# EAGLE design esquemático (EAGLE 9.6.2)
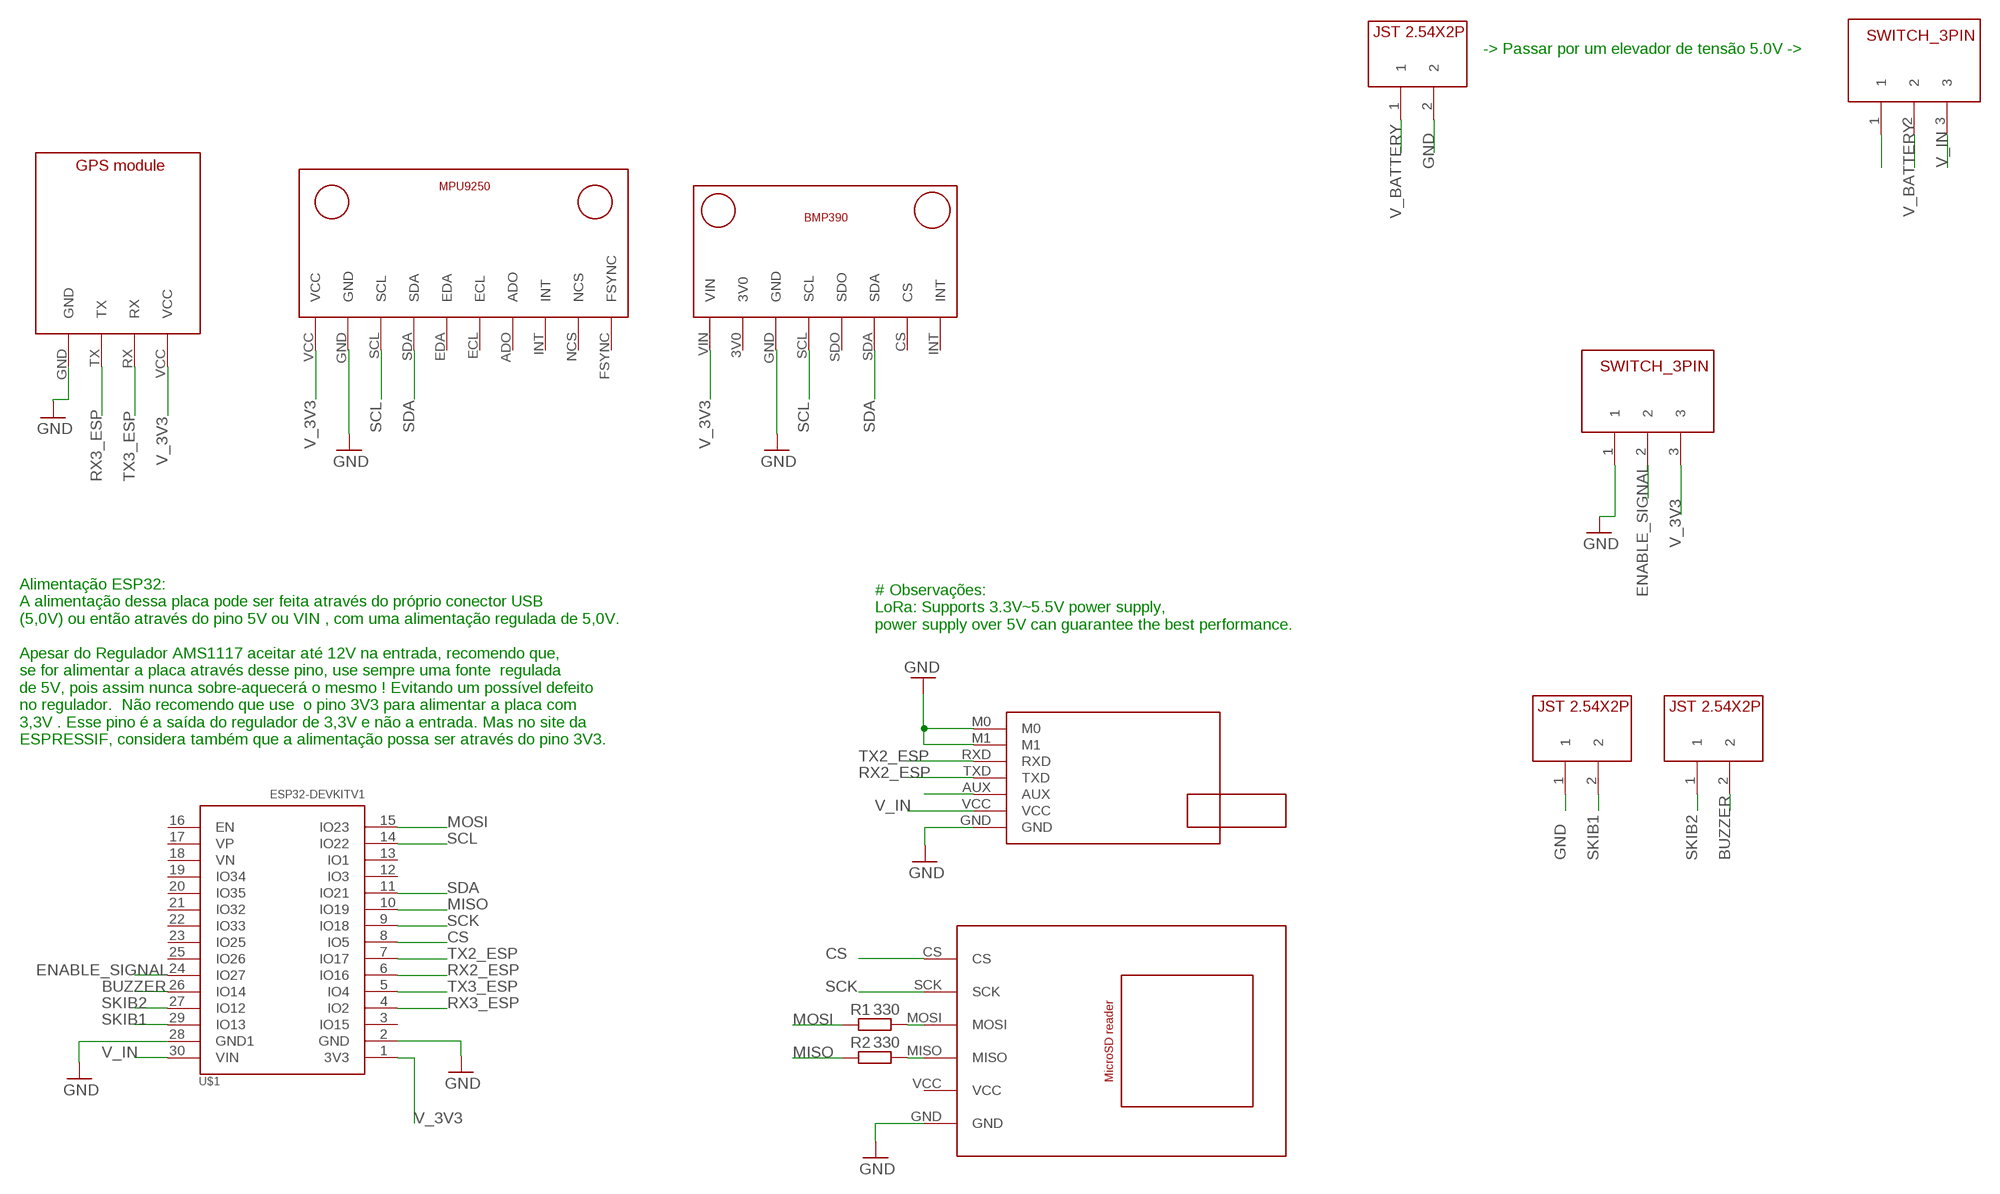
[diagram p0: schematic, sheet 1]

## Parts
R1  330  R-EU_0207/10  [0207/10]
R2  330  R-EU_0207/10  [0207/10]
U$1  ESP32DEVKITV1  [ESP32-DEVKITV1]
U$2  E22-400T30D  [E22-400T30D_FOOTPRINT]
U$3  GPS_MODULE  [GPS_MODULE_FOOTPRINT]
U$5  BMP390V1  [BMP390_FOOTPRINT]
U$6  MPU9250V1  [MPU9250_FOOTPRINT]
U$7  MICROSD_READER  [MICROSD_READER_FOOTPRINT]
U$8  JST2.54X2P  [JST2.54X2P_FOOTPRINT]
U$9  JST2.54X2P  [JST2.54X2P_FOOTPRINT]
U$10  SWITCH_3PIN  [SWITCH_3PIN]
U$11  SWITCH_3PIN  [SWITCH_3PIN]
U$12  JST2.54X2P  [JST2.54X2P_FOOTPRINT]

## Nets
BUZZER: U$1.26(IO14) U$9.2
CS: U$1.8(IO5) U$7.CS
ENABLE_SIGNAL: U$1.24(IO27) U$10.2
GND: U$1.2(GND) U$1.28(GND1) U$2.GND U$2.M0 U$2.M1 U$3.GND U$5.GND U$6.GND U$7.GND U$8.1 U$10.1 U$12.2
MISO: R2.1 U$1.10(IO19)
MOSI: R1.1 U$1.15(IO23)
N$1: R1.2 U$7.MOSI
N$2: R2.2 U$7.MISO
N$3: U$2.AUX
N$4: U$11.1
RX2_ESP: U$1.6(IO16) U$2.TXD
RX3_ESP: U$1.4(IO2) U$3.TX
SCK: U$1.9(IO18) U$7.SCK
SCL: U$1.14(IO22) U$5.SCL U$6.SCL
SDA: U$1.11(IO21) U$5.SDA U$6.SDA
SKIB1: U$1.29(IO13) U$8.2
SKIB2: U$1.27(IO12) U$9.1
TX2_ESP: U$1.7(IO17) U$2.RXD
TX3_ESP: U$1.5(IO4) U$3.RX
V_3V3: U$1.1(3V3) U$3.VCC U$5.VIN U$6.VCC U$10.3
V_BATTERY: U$11.2 U$12.1
V_IN: U$1.30(VIN) U$2.VCC U$11.3
Unconnected: U$1.3(IO15) U$1.12(IO3) U$1.13(IO1) U$1.16(EN) U$1.17(VP) U$1.18(VN) U$1.19(IO34) U$1.20(IO35) U$1.21(IO32) U$1.22(IO33) U$1.23(IO25) U$1.25(IO26) U$5.3V0 U$5.CS U$5.INT U$5.SDO U$6.ADO U$6.ECL U$6.EDA U$6.FSYNC U$6.INT U$6.NCS U$7.VCC

## Notes on the sheet
- -> Passar por um elevador de tensão 5.0V ->
- # Observações:
  LoRa: Supports 3.3V~5.5V power supply, 
  power supply over 5V can guarantee the best performance.
- Alimentação ESP32:
  A alimentação dessa placa pode ser feita através do próprio conector USB
  (5,0V) ou então através do pino 5V ou VIN , com uma alimentação regulada de 5,0V.
  
  Apesar do Regulador AMS1117 aceitar até 12V na entrada, recomendo que,
  se for alimentar a placa através desse pino, use sempre uma fonte  regulada
  de 5V, pois assim nunca sobre-aquecerá o mesmo ! Evitando um possível defeito
  no regulador.  Não recomendo que use  o pino 3V3 para alimentar a placa com
  3,3V . Esse pino é a saída do regulador de 3,3V e não a entrada. Mas no site da
  ESPRESSIF, considera também que a alimentação possa ser através do pino 3V3.

## Library data of the parts
R1 R2 = rcl:R-EU_: RESISTOR, European symbol; SPICEPREFIX: R
U$1 = ESP32-DEVKITV1:ESP32DEVKITV1
U$2 = CRD:E22-400T30D
U$3 = CRD:GPS_MODULE
U$5 = CRD:BMP390: Sensor barométrico
U$6 = CRD:MPU9250: Acelerômetro e Giroscópio
U$7 = CRD:MICROSD_READER: Leitor e gravador de cartão SD
U$8 U$9 U$12 = CRD:JST2.54X2P: Conector JST 2 pinos (2.54mm de distância entre pinos)
U$10 U$11 = CRD:SWITCH_3PIN

## Board
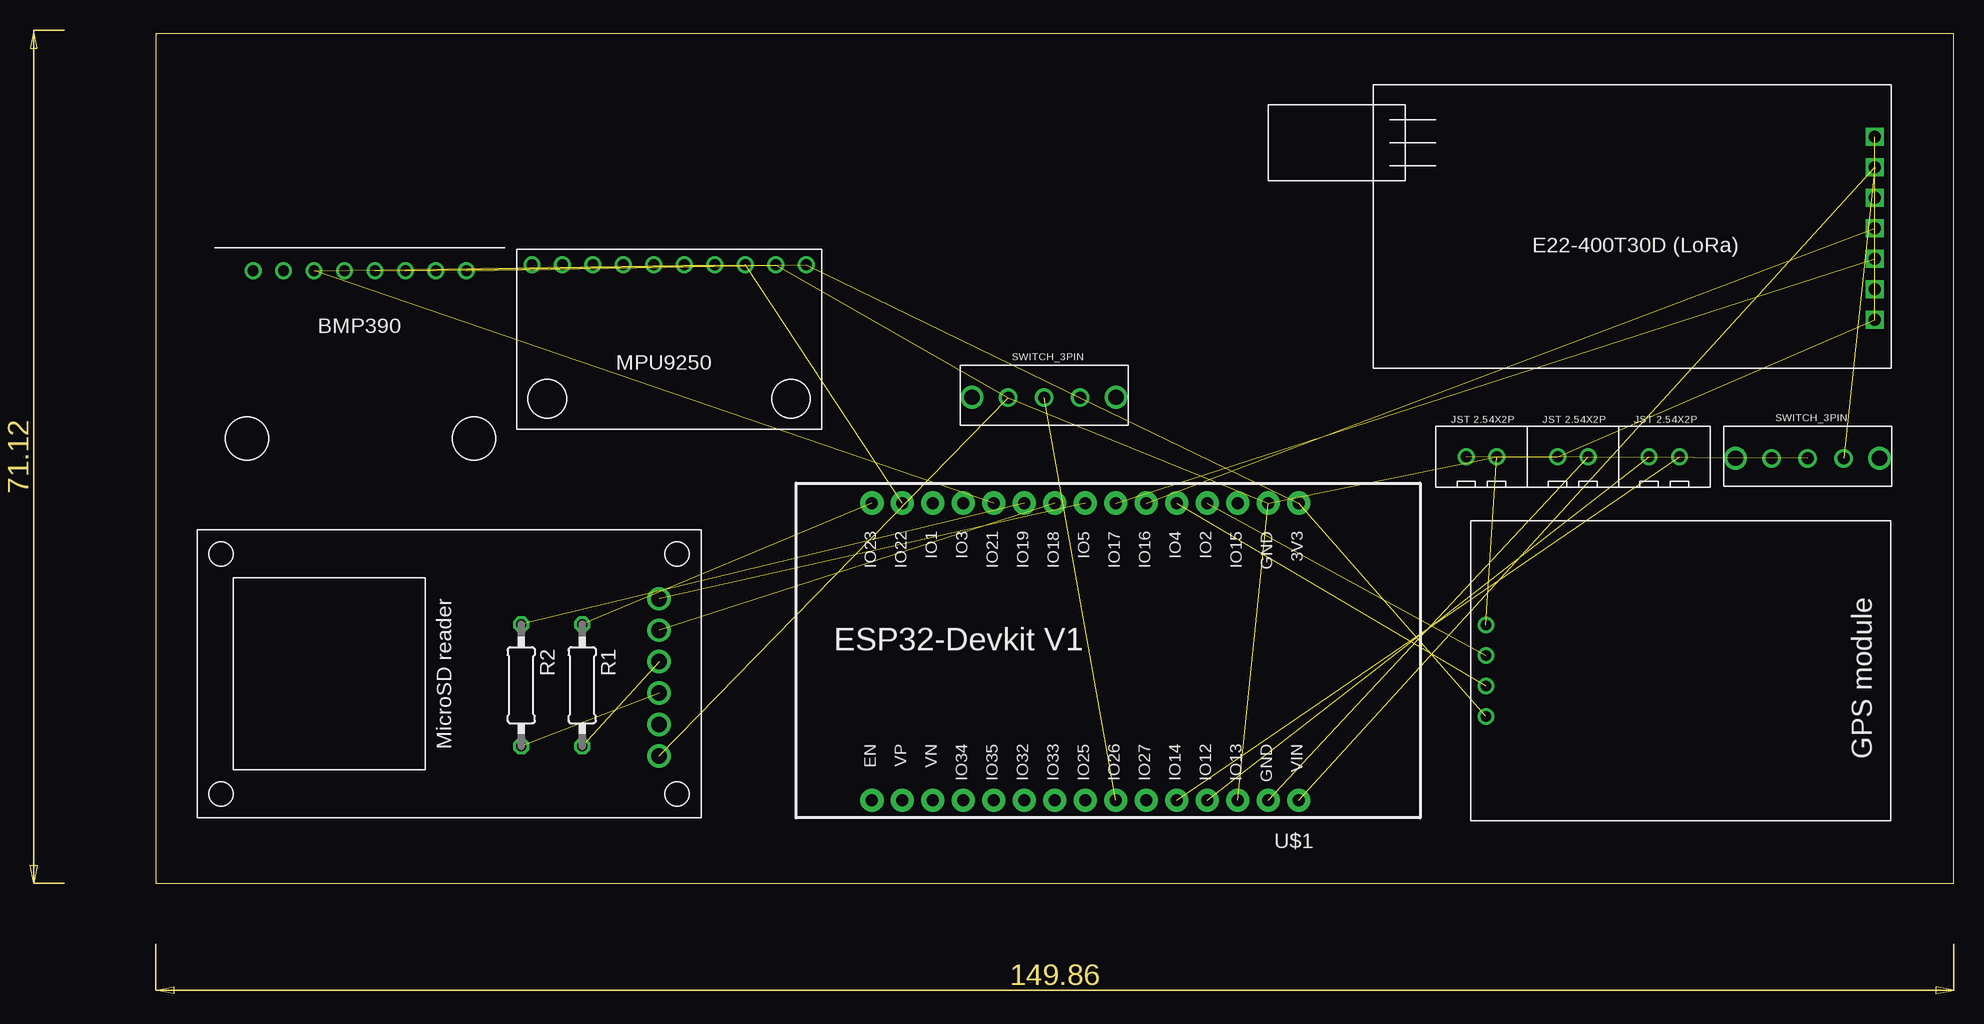
[diagram p1: board, top side]
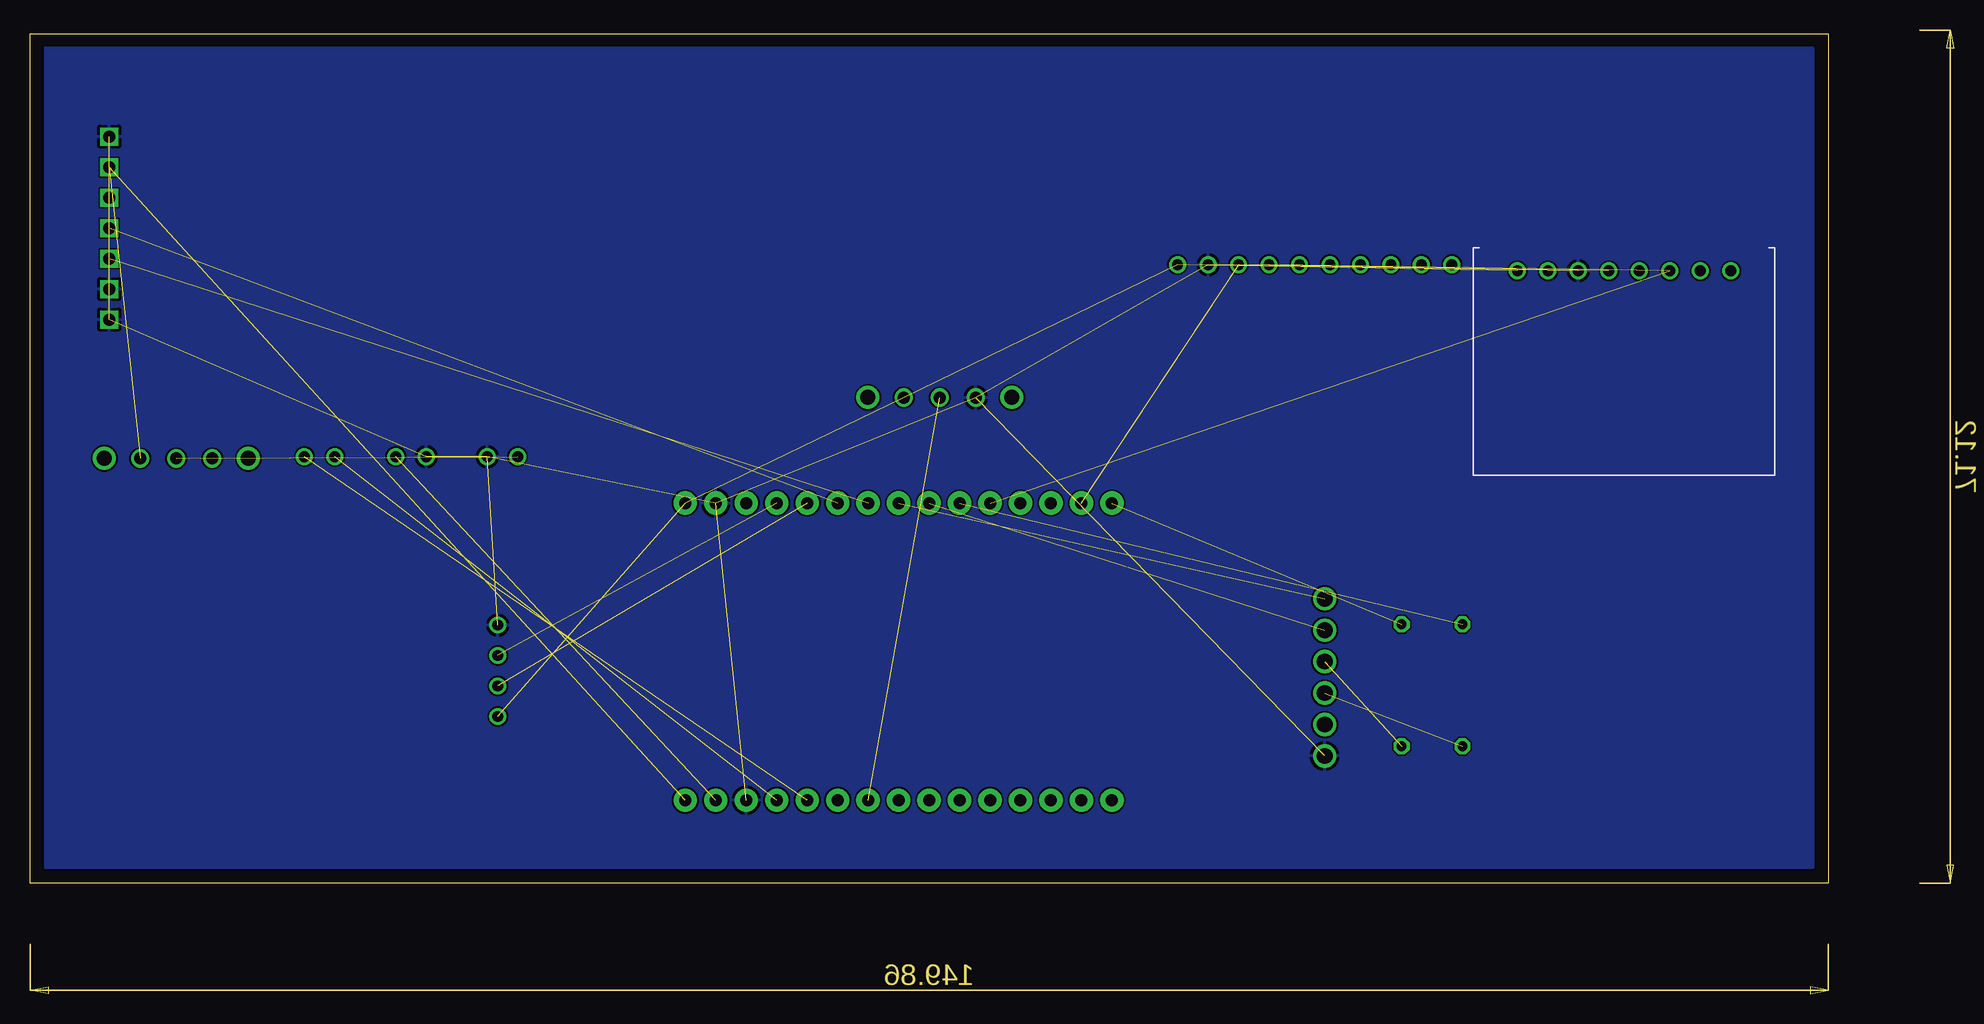
[diagram p2: board, bottom side, seen from below]

Size 149.84 x 70.79 mm. Coordinates in mm from the lower left corner, seen from the top.
Outline: 0,0 149.84,0 149.84,70.79 0,70.79 0,0
Copper layers (1*16): Top 0.035mm / dielectric 1.5mm / Bottom 0.035mm
Design rules "default": minimum track width 6mil, minimum drill 0.35mm, track to track 6mil, track to pad 6mil, pad to pad 6mil, via to via 6mil, smd to smd 6mil, copper to edge 40mil, drill to drill 6mil, minimum pad ring 10mil, minimum via ring 8mil, stop-mask expansion 4mil, vias tented up to drill 0mil, thermal gap 10mil

### Footprints (pad centres in the part's own frame; a part is rotated, then mirrored left to right if it is on the bottom)
0207/10 = drill 0.813 octagon: 1 -5.08,0; 2 5.08,0
ESP32-DEVKITV1 = drill 1 pad 1.93: 1 -22.87,-13.54; 2 -20.33,-13.54; 3 -17.79,-13.54; 4 -15.25,-13.54; 5 -12.71,-13.54; 6 -10.17,-13.54; 7 -7.63,-13.54; 8 -5.09,-13.54; 9 -2.55,-13.54; 10 -0.01,-13.54; 11 2.53,-13.54; 12 5.07,-13.54; 13 7.61,-13.54; 14 10.15,-13.54; 15 12.69,-13.54; 16 12.69,11.23; 17 10.15,11.23; 18 7.61,11.23; 19 5.07,11.23; 20 2.53,11.23; 21 -0.01,11.23; 22 -2.55,11.23; 23 -5.09,11.23; 24 -7.63,11.23; 25 -10.17,11.23; 26 -12.71,11.23; 27 -15.25,11.23; 28 -17.79,11.23; 29 -20.33,11.23; 30 -22.87,11.23
E22-400T30D_FOOTPRINT = drill 1 square: AUX -16.383,-0.762; GND -16.383,-5.842; M0 -16.383,9.398; M1 -16.383,6.858; RXD -16.383,4.318; TXD -16.383,1.778; VCC -16.383,-3.302
GPS_MODULE_FOOTPRINT = drill 0.9: GND -4.01,-16.51; RX 1.07,-16.51; TX -1.47,-16.51; VCC 3.61,-16.51
BMP390_FOOTPRINT = drill 0.9: 3V0 -5.969,-8.382; CS 6.731,-8.382; GND -3.429,-8.382; INT 9.271,-8.382; SCL -0.889,-8.382; SDA 4.191,-8.382; SDO 1.651,-8.382; VIN -8.509,-8.382
MPU9250_FOOTPRINT = drill 0.9: ADO 3.81,-6.35; ECL 1.27,-6.35; EDA -1.27,-6.35; FSYNC 11.43,-6.35; GND -8.89,-6.35; INT 6.35,-6.35; NCS 8.89,-6.35; SCL -6.35,-6.35; SDA -3.81,-6.35; VCC -11.43,-6.35
MICROSD_READER_FOOTPRINT = drill 1.3: CS 6.449,-8.692; GND -6.651,-8.692; MISO -1.411,-8.692; MOSI 1.209,-8.692; SCK 3.829,-8.692; VCC -4.031,-8.692
JST2.54X2P_FOOTPRINT = drill 0.9: 1 -1.27,0; 2 1.27,0
SWITCH_3PIN = drill 1: 1 -3,-0.018; 2 0,-0.018; 3 3,-0.018 | drill 1.27: P$1 -6,0; P$2 6,0

### Placement (x,y rotation side)
R1  35.56,16.51 270 top
R2  30.48,16.51 270 top
U$1  72.39,18.16 180 top
U$2  126.87,56.39 180 top
U$3  127.38,17.53 270 top
U$5  17.4,42.67 180 top
U$6  42.8,45.21 180 top
U$7  33.27,17.27 90 top
U$8  118.11,35.56 0 top
U$9  125.73,35.56 0 top
U$10  74.04,40.51 0 top
U$11  137.67,35.43 0 top
U$12  110.49,35.56 0 top

### Tracks (layer width: path | path; a pad name or v marks a point on that pad's centre or on a via)
BUZZER  (1 unrouted)
CS  (1 unrouted)
ENABLE_SIGNAL  (1 unrouted)
GND  (11 unrouted)
  pour Bottom: 1.27,69.85 1.27,1.27 148.59,1.27 148.59,69.85
MISO  (1 unrouted)
MOSI  (1 unrouted)
N$1  (1 unrouted)
N$2  (1 unrouted)
RX2_ESP  (1 unrouted)
RX3_ESP  (1 unrouted)
SCK  (1 unrouted)
SCL  (2 unrouted)
SDA  (2 unrouted)
SKIB1  (1 unrouted)
SKIB2  (1 unrouted)
TX2_ESP  (1 unrouted)
TX3_ESP  (1 unrouted)
V_3V3  (4 unrouted)
V_BATTERY  (1 unrouted)
V_IN  (2 unrouted)